# Altium schematic sheet Interface.SchDoc
size A4; SheetNumber: 1; SheetTotal: 5
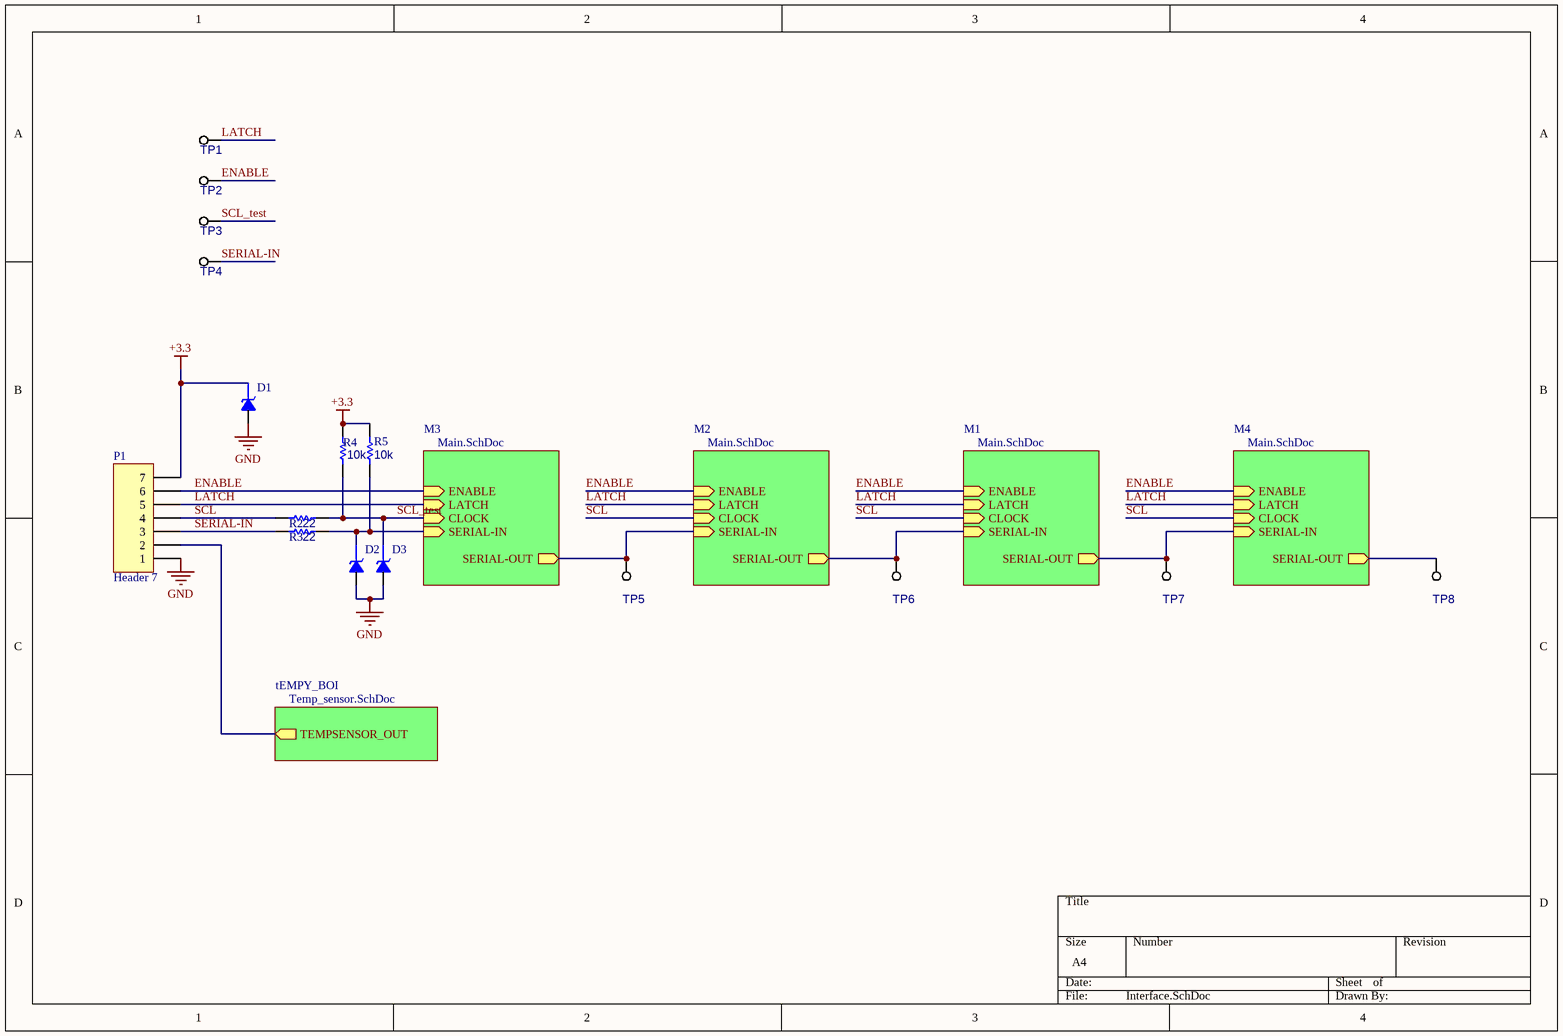
[diagram p0: Interface.SchDoc]

## Parts
D1  STS521033B950  [STS521033B950_COB]  (value not drawn)
D2  STS521033B950  [STS521033B950_COB]  (value not drawn)
D3  STS521033B950  [STS521033B950_COB]  (value not drawn)
P1  Header 7  [HDR1X7]
R2  value 22  [R0603A]  (hidden comment: Resistor)
R3  value 22  [R0603A]  (hidden comment: Resistor)
R4  value 10k  [R0603A]  (hidden comment: Resistor)
R5  value 10k  [R0603A]  (hidden comment: Resistor)
TP1  Test Point  [TP-SMT-1mm]  (value not drawn)  (no BOM)
TP2  Test Point  [TP-SMT-1mm]  (value not drawn)  (no BOM)
TP3  Test Point  [TP-SMT-1mm]  (value not drawn)  (no BOM)
TP4  Test Point  [TP-SMT-1mm]  (value not drawn)  (no BOM)
TP5  Test Point  [TP-SMT-1mm]  (value not drawn)  (no BOM)
TP6  Test Point  [TP-SMT-1mm]  (value not drawn)  (no BOM)
TP7  Test Point  [TP-SMT-1mm]  (value not drawn)  (no BOM)
TP8  Test Point  [TP-SMT-1mm]  (value not drawn)  (no BOM)

## Sub-sheets
M1 = Main.SchDoc: LATCH (in), ENABLE (in), CLOCK (in), SERIAL-IN (in), SERIAL-OUT (out)
M2 = Main.SchDoc: LATCH (in), ENABLE (in), CLOCK (in), SERIAL-IN (in), SERIAL-OUT (out)
M3 = Main.SchDoc: LATCH (in), ENABLE (in), CLOCK (in), SERIAL-IN (in), SERIAL-OUT (out)
M4 = Main.SchDoc: LATCH (in), ENABLE (in), CLOCK (in), SERIAL-IN (in), SERIAL-OUT (out)
tEMPY_BOI = Temp_sensor.SchDoc: TEMPSENSOR_OUT (out)

## Nets
+3.3: D1.1(K) P1.7 R4.1 R5.1
GND: D1.2(A) D2.2(A) D3.2(A) P1.1
ENABLE: P1.6 TP2.1(Pad) ; sheet M1/ENABLE, sheet M2/ENABLE, sheet M3/ENABLE, sheet M4/ENABLE
LATCH: P1.5 TP1.1(Pad) ; sheet M1/LATCH, sheet M2/LATCH, sheet M3/LATCH, sheet M4/LATCH
SCL: P1.4 R2.2 ; sheet M1/CLOCK, sheet M2/CLOCK, sheet M4/CLOCK
SCL_test: D3.1(K) R2.1 R4.2 TP3.1(Pad) ; sheet M3/CLOCK
SERIAL-IN: P1.3 R3.2 TP4.1(Pad)
NetD2_1: D2.1(K) R3.1 R5.2 ; sheet M3/SERIAL-IN
NetP1_2: P1.2 ; sheet tEMPY_BOI/TEMPSENSOR_OUT
NetTP5_1: TP5.1(Pad) ; sheet M2/SERIAL-IN, sheet M3/SERIAL-OUT
NetTP6_1: TP6.1(Pad) ; sheet M1/SERIAL-IN, sheet M2/SERIAL-OUT
NetTP7_1: TP7.1(Pad) ; sheet M1/SERIAL-OUT, sheet M4/SERIAL-IN
NetTP8_1: TP8.1(Pad) ; sheet M4/SERIAL-OUT

## Library data of the parts
D1-D3 = CMP-245-000001-7: 3.3V ESD Diode; Mfr_Name: Eaton / Cooper Bussmann; Type: DEV; Copyright: Copyright (C) 2023 Ultra Librarian. All rights reserved.; RefDes: RefDes; Manufacturer_Part_Number: STS521033B950; Design Item ID: STS521033B950; Source: STS521033B950.SchLib
P1 = CMP-005-000112-1: Header, 7-Pin; Signal Integrity: Connector; Design Item ID: Header 7; Component Type: Standard; Source: Miscellaneous Connectors.SchLib; LatestRevisionDate: 17-Jul-2002; LatestRevisionNote: Re-released for DXP Platform.; Publisher: Altium Limited; Pin Count: 7
R2-R5 = CMP-009-00002-14
TP1-TP8 = CMP-002-00006-5: In circuit test point for a net